# EAGLE schematic Buggy Motor Board (EAGLE 7.4.0)
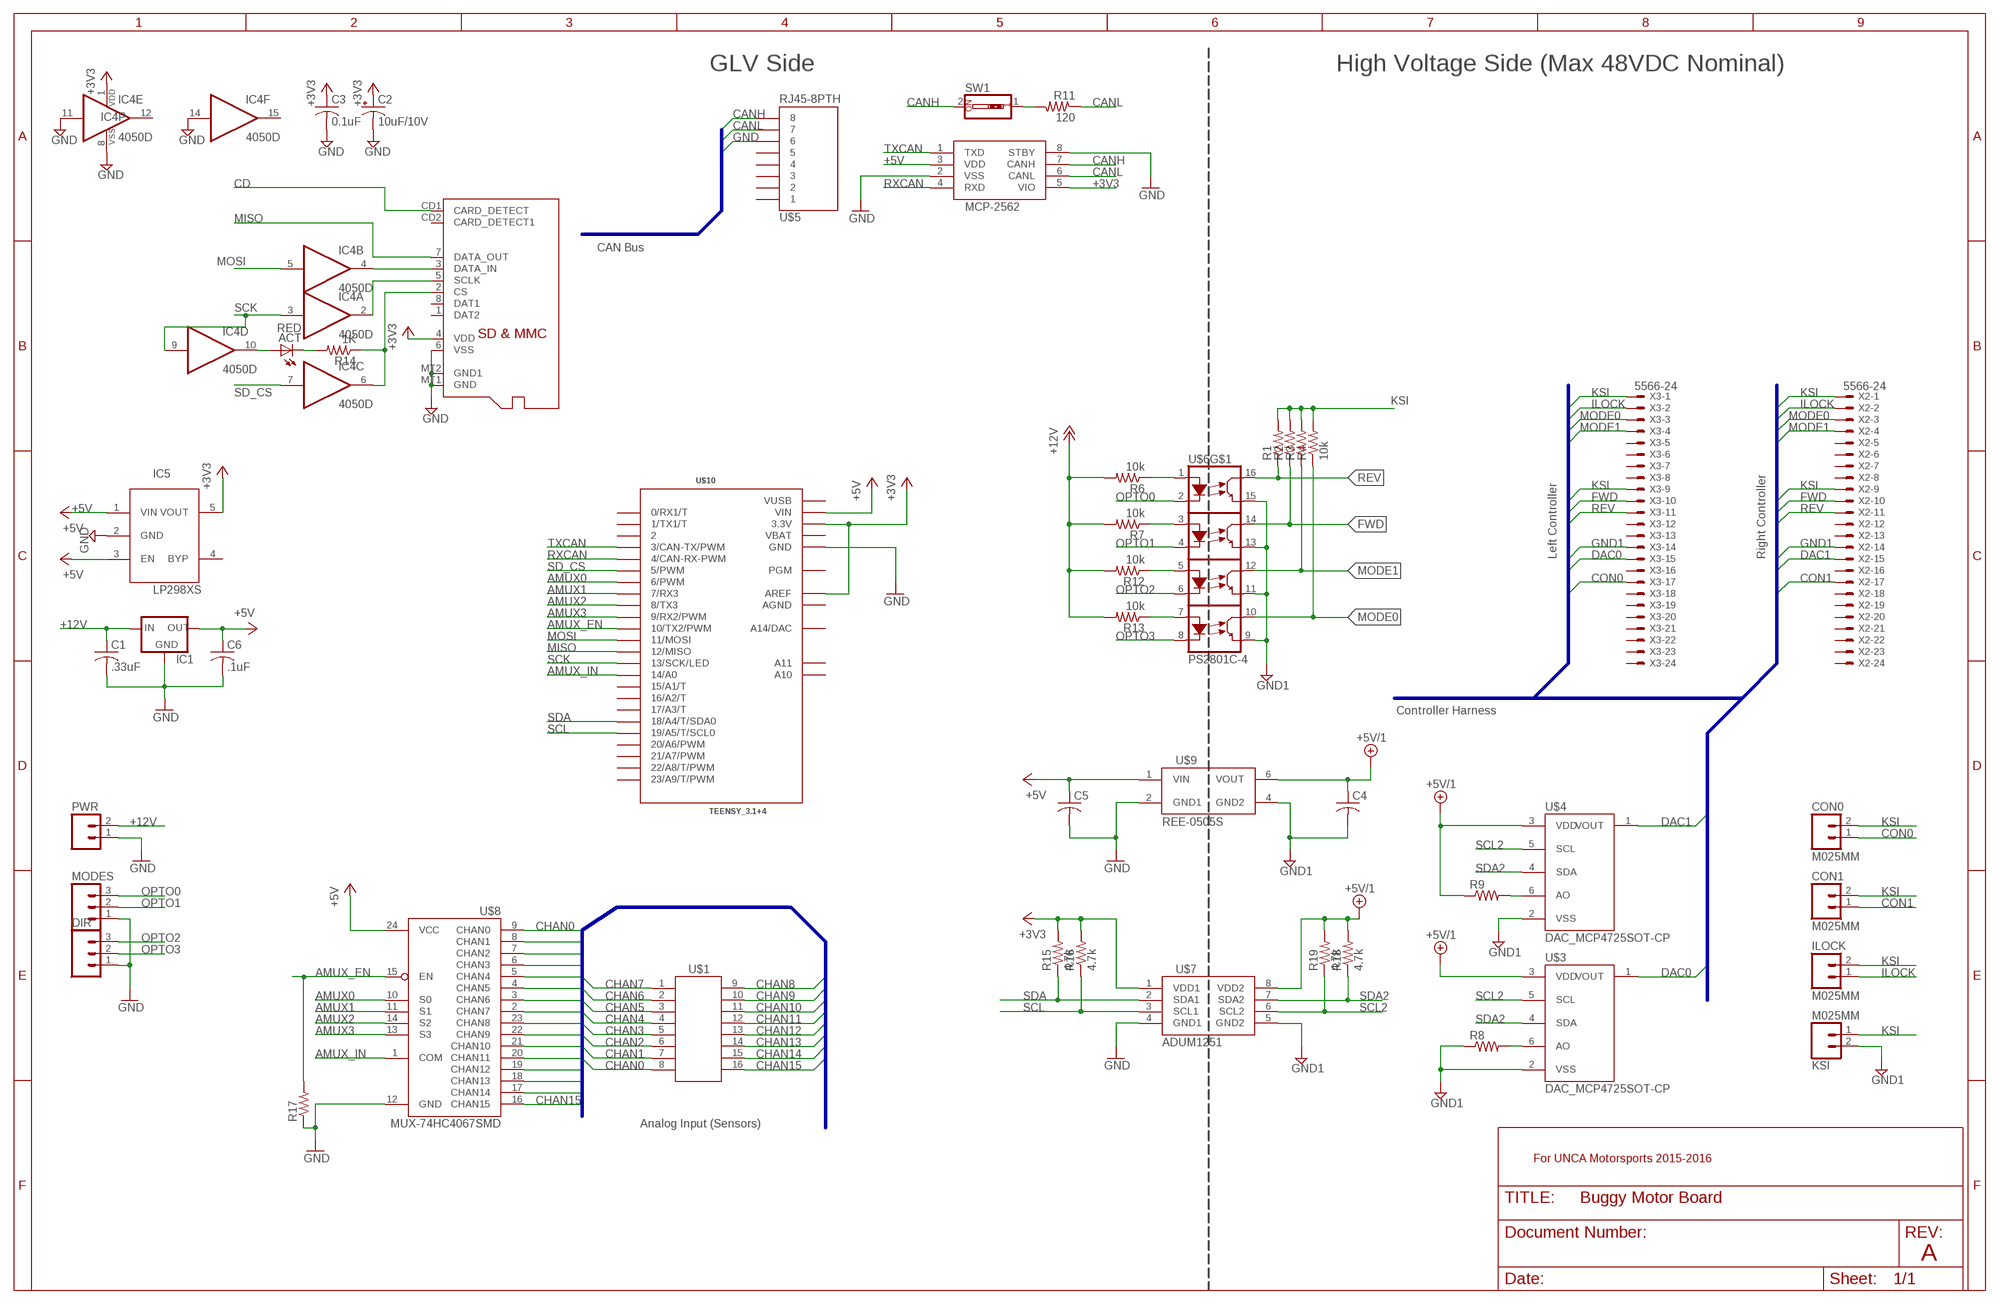
[diagram p0: schematic, sheet 1]

## Parts
ACT  RED  LEDCHIP-LED0805  [CHIP-LED0805]
C1  .33uF  C-USC0805  [C0805]
C2  10uF/10V  CPOL-USA/3216-18R  [A/3216-18R]
C3  0.1uF  C-USC0805K  [C0805K]
C4  C-USC1210K  [C1210K]
C5  C-USC1210K  [C1210K]
C6  .1uF  C-USC0805  [C0805]
CON0  M025MM  [SCREWTERMINAL-5MM-2]
CON1  M025MM  [SCREWTERMINAL-5MM-2]
DIR  M03SCREW_LOCK  [SCREWTERMINAL-3.5MM-3_LOCK.007S]
IC1  V_REG_78XXSIDE  [78XXL]
IC4  4050D  [SO16]
IC5  LP298XS  [SOT23-5L]
ILOCK  M025MM  [SCREWTERMINAL-5MM-2]
KSI  M025MM  [SCREWTERMINAL-5MM-2]
MCP-2562  MCP2562  [SO08]
MODES  M03SCREW_LOCK  [SCREWTERMINAL-3.5MM-3_LOCK.007S]
PWR  M023.5MM_LOCK  [SCREWTERMINAL-3.5MM-2_LOCK]
R1  RESISTOR0805-RES  [0805]
R2  RESISTOR0805-RES  [0805]
R3  RESISTOR0805-RES  [0805]
R4  10k  RESISTOR0805-RES  [0805]
R6  10k  RESISTOR0805-RES  [0805]
R7  10k  RESISTOR0805-RES  [0805]
R8  RESISTOR0805-RES  [0805]
R9  RESISTOR0805-RES  [0805]
R11  120  RESISTOR0805-RES  [0805]
R12  10k  RESISTOR0805-RES  [0805]
R13  10k  RESISTOR0805-RES  [0805]
R14  1K  RESISTOR0805-RES  [0805]
R15  4.7k  RESISTOR0805-RES  [0805]
R16  4.7k  RESISTOR0805-RES  [0805]
R17  RESISTOR0805-RES  [0805]
R18  4.7k  RESISTOR0805-RES  [0805]
R19  4.7k  RESISTOR0805-RES  [0805]
SW1  SW_DIP-1  [EDG-01]
U$1  WM9300  [WM9300]
U$3  DAC_MCP4725SOT-CP  [SOT23-6-MCP4725]
U$4  DAC_MCP4725SOT-CP  [SOT23-6-MCP4725]
U$5  RJ45-8PTH  [RJ45-8]
U$6  PS2801C-4  [16-SOIC]
U$7  ADUM1251  [8-SOIC]
U$8  MUX-74HC4067SMD  [SSOP24]
U$9  REE-0505S  [REE-0505S]
U$10  TEENSY_3.1+4  [TEENSY_3.1+4]
X1  MICROSD  [MICROSD]
X2  5566-24  [5566-24]
X3  5566-24  [5566-24]

## Nets
+3V3: C2.+ C3.1 IC4.1(P:VDD) IC5.5(VOUT) MCP-2562.5(VIO) R15.2 R16.2 U$7.1(VDD1) U$10.3.3V U$10.3.3V1(3.3V) U$10.AREF X1.4(VDD)
+5V: C5.1 C6.1 IC1.OUT IC5.1(VIN) IC5.3(EN) MCP-2562.3(VDD) U$8.24(VCC) U$9.1(VIN) U$10.VIN
+5V/1: C4.1 R9.1 R18.2 R19.2 U$3.3(VDD) U$4.3(VDD) U$7.8(VDD2) U$9.6(VOUT)
+12V: C1.1 IC1.IN PWR.2 R6.2 R7.2 R12.2 R13.2
AMUX0: U$8.10(S0) U$10.6(6/PWM)
AMUX1: U$8.11(S1) U$10.7(7/RX3)
AMUX2: U$8.14(S2) U$10.8(8/TX3)
AMUX3: U$8.13(S3) U$10.9(9/RX2/PWM)
AMUX_EN: R17.2 U$8.15(EN) U$10.10(10/TX2/PWM)
AMUX_IN: U$8.1(COM) U$10.14/A0
CANH: MCP-2562.7(CANH) SW1.2 U$5.8
CANL: MCP-2562.6(CANL) R11.1 U$5.7
CD: X1.CD1(CARD_DETECT)
CHAN0: U$1.8 U$8.9(CHAN0)
CHAN1: U$1.7 U$8.8(CHAN1)
CHAN2: U$1.6 U$8.7(CHAN2)
CHAN3: U$1.5 U$8.6(CHAN3)
CHAN4: U$1.4 U$8.5(CHAN4)
CHAN5: U$1.3 U$8.4(CHAN5)
CHAN6: U$1.2 U$8.3(CHAN6)
CHAN7: U$1.1 U$8.2(CHAN7)
CHAN8: U$1.9 U$8.23(CHAN8)
CHAN9: U$1.10 U$8.22(CHAN9)
CHAN10: U$1.11 U$8.21(CHAN10)
CHAN11: U$1.12 U$8.20(CHAN11)
CHAN12: U$1.13 U$8.19(CHAN12)
CHAN13: U$1.14 U$8.18(CHAN13)
CHAN14: U$1.15 U$8.17(CHAN14)
CHAN15: U$1.16 U$8.16(CHAN15)
CON0: CON0.1 X3.17
CON1: CON1.1 X2.17
DAC0: U$3.1(VOUT) X3.15
DAC1: U$4.1(VOUT) X2.15
FWD: R2.1 U$6.14(L1) X2.10 X3.10
GND: C1.2 C2.- C3.2 C5.2 C6.2 DIR.1 IC1.GND IC4.8(P:VSS) IC4.11(E:I) IC4.14(F:I) IC5.2(GND) MCP-2562.2(VSS) MCP-2562.8(STBY) MODES.1 PWR.1 R17.1 U$5.6 U$7.4(GND1) U$8.12(GND) U$9.2(GND1) U$10.GND U$10.GND1(GND) X1.6(VSS) X1.MT1(GND) X1.MT2(GND1)
GND1: C4.2 KSI.2 R8.1 U$3.2(VSS) U$4.2(VSS) U$6.9(L2) U$6.11(L2) U$6.13(L2) U$6.15(L2) U$7.5(GND2) U$9.4(GND2) X2.14 X3.14
ILOCK: ILOCK.1 X2.2 X3.2
KSI: CON0.2 CON1.2 ILOCK.2 KSI.1 R1.2 R2.2 R3.2 R4.2 X2.1 X2.9 X3.1 X3.9
MISO: U$10.12(12/MISO) X1.7(DATA_OUT)
MODE0: R4.1 U$6.10(L1) X2.3 X3.3
MODE1: R3.1 U$6.12(L1) X2.4 X3.4
MOSI: IC4.5(B:I) U$10.11(11/MOSI)
N$7: R8.2 U$3.6(AO)
N$8: R9.2 U$4.6(AO)
N$12: R6.1 U$6.1(A)
N$13: R11.2 SW1.1
N$15: R7.1 U$6.3(A)
N$17: ACT.A IC4.10(D:O)
N$18: IC4.2(A:O) X1.5(SCLK)
N$19: IC4.6(C:O) R14.1 X1.2(CS)
N$20: ACT.C R14.2
N$21: IC4.4(B:O) X1.3(DATA_IN)
N$27: R12.1 U$6.5(A)
N$29: R13.1 U$6.7(A)
OPTO0: MODES.3 U$6.2(C)
OPTO1: MODES.2 U$6.4(C)
OPTO2: DIR.3 U$6.6(C)
OPTO3: DIR.2 U$6.8(C)
REV: R1.1 U$6.16(L1) X2.11 X3.11
RXCAN: MCP-2562.4(RXD) U$10.4(4/CAN-RX-PWM)
SCK: IC4.3(A:I) IC4.9(D:I) U$10.13(13/SCK/LED)
SCL: R16.1 U$7.3(SCL1) U$10.19/A5(19/A5/T/SCL0)
SCL2: R19.1 U$3.5(SCL) U$4.5(SCL) U$7.6(SCL2)
SD_CS: IC4.7(C:I) U$10.5(5/PWM)
SDA: R15.1 U$7.2(SDA1) U$10.18/A4(18/A4/T/SDA0)
SDA2: R18.1 U$3.4(SDA) U$4.4(SDA) U$7.7(SDA2)
TXCAN: MCP-2562.1(TXD) U$10.3(3/CAN-TX/PWM)
Unconnected: IC4.12(E:O) IC4.15(F:O) IC5.4(BYP) U$5.1 U$5.2 U$5.3 U$5.4 U$5.5 U$10.0(0/RX1/T) U$10.1(1/TX1/T) U$10.2 U$10.15/A1(15/A1/T) U$10.16/A2(16/A2/T) U$10.17/A3(17/A3/T) U$10.20/A6(20/A6/PWM) U$10.21/A7(21/A7/PWM) U$10.22/A8(22/A8/T/PWM) U$10.23/A9(23/A9/T/PWM) U$10.A10 U$10.A11 U$10.A14(A14/DAC) U$10.PGM X1.1(DAT2) X1.8(DAT1) X1.CD2(CARD_DETECT1) X2.5 X2.6 X2.7 X2.8 X2.12 X2.13 X2.16 X2.18 X2.19 X2.20 X2.21 X2.22 X2.23 X2.24 X3.5 X3.6 X3.7 X3.8 X3.12 X3.13 X3.16 X3.18 X3.19 X3.20 X3.21 X3.22 X3.23 X3.24

## Buses
CANH,CANL,GND
CHAN[0..15]
KSI,ILOCK,CON[0..1],DAC[0..1],MODE[0..1],FWD,REV,AGND,GND1

## Notes on the sheet
- GLV Side | High Voltage Side (Max 48VDC Nominal)
- CAN Bus
- Left Controller | Right Controller
- Controller Harness
- Analog Input (Sensors)
- For UNCA Motorsports 2015-2016
- A

## Power pins joined to a net without a drawn wire
AGND: U$10.AGND
VBAT: U$10.VBAT
VUSB: U$10.VUSB

## Library data of the parts
ACT = adafruit:LED: LED OSRAM: - CHIPLED LG R971, LG N971, LY N971, LG Q971, LY Q971, LO R971, LY R971 LH N974, LH R974 LS Q976, LO Q976, LY Q976 LO Q996 - Hyper CHIPLED LW Q18S LB Q993, LB Q99A, LB R99A - SideLED LS A670, LO A670, LY A670, LG A670, LP A670 LB A673, LV A673, LT A673, LW A673 LH A674 LY A675 LS A676, LA A676, LO A676, LY A676, LW A676 LS A679, LY A679, LG A679 - Hyper Micro SIDELED® LS Y876, LA Y876, LO Y876, LY Y876 LT Y87S - SmartLED LW L88C, LW L88S LB L89C, LB L89S, LG L890 LS L89K, LO L89K, LY L89K LS L896, LA L896, LO L896, LY L896 - TOPLED LS T670, LO T670, LY T670, LG T670, LP T670 LSG T670, LSP T670, LSY T670, LOP T670, LYG T670 LG T671, LOG T671, LSG T671 LB T673, LV T673, LT T673, LW T673 LH T674 LS T676, LA T676, LO T676, LY T676, LB T676, LH T676, LSB T676, LW T676 LB T67C, LV T67C, LT T67C, LS T67K, LO T67K, LY T67K, LW E67C LS E67B, LA E67B, LO E67B, LY E67B, LB E67C, LV E67C, LT E67C LW T67C LS T679, LY T679, LG T679 LS T770, LO T770, LY T770, LG T770, LP T770 LB T773, LV T773, LT T773, LW T773 LH T774 LS E675, LA E675, LY E675, LS T675 LS T776, LA T776, LO T776, LY T776, LB T776 LHGB T686 LT T68C, LB T68C - Hyper Mini TOPLED® LB M676 - Mini TOPLED Santana® LG M470 LS M47K, LO M47K, LY M47K Source: http://www.osram.convergy.de/
C1 C4-C6 = rcl:C-US: CAPACITOR, American symbol
C2 = adafruit:CPOL-US: POLARIZED CAPACITOR, American symbol
C3 = adafruit:C-US: CAPACITOR, American symbol
CON0 CON1 ILOCK KSI PWR = SparkFun-Connectors:M02: Standard 2-pin 0.1" header. Use with - straight break away headers ( PRT-00116) - right angle break away headers (PRT-00553) - swiss pins (PRT-00743) - machine pins (PRT-00117) - female headers (PRT-00115) Molex polarized connector foot print use with: PRT-08233 with associated crimp pins and housings. 2.54_SCREWTERM for use with PRT-10571. 3.5mm Screw Terminal footprints for PRT-08084 5mm Screw Terminal footprints for use with PRT-08433
DIR MODES = SparkFun-Connectors:M03: Header 3 Standard 3-pin 0.1" header. Use with straight break away headers (SKU : PRT-00116), right angle break away headers (PRT-00553), swiss pins (PRT-00743), machine pins (PRT-00117), and female headers (PRT-00115). Molex polarized connector foot print use with SKU : PRT-08232 with associated crimp pins and housings.
IC1 = SparkFun-PowerIC:V_REG_78XX: Voltage Regulator Standard 7805 5V regulator. IGO (Input Ground Output). Spark Fun Electronics SKU : COM-00107
IC4 = 40xx:4050: Hex non-inverting BUFFER
IC5 = adafruit:LP298X
MCP-2562 = Wetmelon-DigitalIC:MCP2562: CAN transceiver
R1-R4 R6-R9 R11-R19 = SparkFun-Resistors:RESISTOR: Resistor Basic schematic elements and footprints for 0603, 1206, and PTH resistors.
SW1 = special:SW_DIP-1: DIP SWITCH
U$1 = Wetmelon-Connectors:WM9300
U$3 U$4 = SparkFun-AnalogIC:DAC_MCP4725: Microchip 12-bit I2C DAC, SOT23-6
U$5 = SparkFun-Connectors:RJ45-8: RJ45 Jack Simple RJ45, 8-pin connection - connector for common Cat5, Cat5e, and Cat6 Ethernet cables. Footprint not yet proven in production. Connector sku is PRT-00643; Breakout PCB sku is BOB-00716.
U$6 = Wetmelon-DiscreteSemi:PS2801C-4: 4 Channel Optocoupler / Optoisolator
U$7 = Wetmelon-DigitalIC:ADUM1251: Dual I2C Isolator The ADuM1250/ADuM12511 are hot swappable digital isolators with nonlatching, bidirectional communication channels that are compatible with I2 C interfaces. This eliminates the need for splitting I2 C signals into separate transmit and receive signals for use with standalone optocouplers. http://www.analog.com/media/en/technical-documentation/data-sheets/ADUM1250_1251.pdf
U$8 = SparkFun-AnalogIC:MUX-74HC4067: 16-channel analog MUX
U$9 = Wetmelon-PowerIC:REE-0505S: 1 Watt Isolated DC-DC Converter 5v - 5v Isolated Switching Regulator http://www.recom-power.com/pdf/Econoline/REE.pdf
U$10 = Teensy_3_Series_Board_v1.0:TEENSY_3.1+4: Footprint for Teensy 3.1 board using all through-holes, i.e. the entire perimeter plus the 4 through-holes inboard (A10,A11,AREF, VUSB)
X1 = adafruit:MICROSD: Micro-SD / Transflash card holder with SPI pinout For the 3M # 2908-05WB-MG and/or 4UCON #19656 push-push type
X2 X3 = con-molex:5566-24: Mini FIT connector 24 pol Source: http://www.molex.com; OC_FARNELL: unknown; OC_NEWARK: unknown